# Altium schematic sheet AD9363_RF.SchDoc
size A4
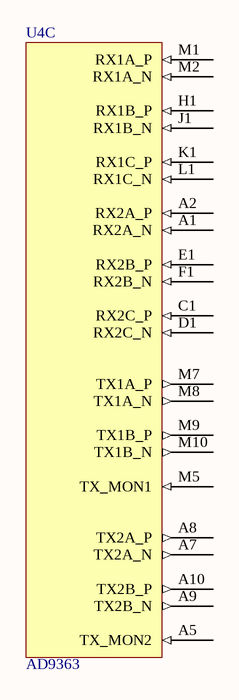
[diagram p0: AD9363_RF.SchDoc]

## Parts
U4  AD9363  (part C of 5)

## Nets

Not connected (* = marked no-connect by the designer): U4 A1(RX2A_N) A2(RX2A_P) A5(TX_MON2) A7(TX2A_N) A8(TX2A_P) A9(TX2B_N) A10(TX2B_P) C1(RX2C_P) D1(RX2C_N) E1(RX2B_P) F1(RX2B_N) H1(RX1B_P) J1(RX1B_N) K1(RX1C_P) L1(RX1C_N) M1(RX1A_P) M2(RX1A_N) M5(TX_MON1) M7(TX1A_P) M8(TX1A_N) M9(TX1B_P) M10(TX1B_N)